# EAGLE design diybmsv4-00 (EAGLE 6.1)
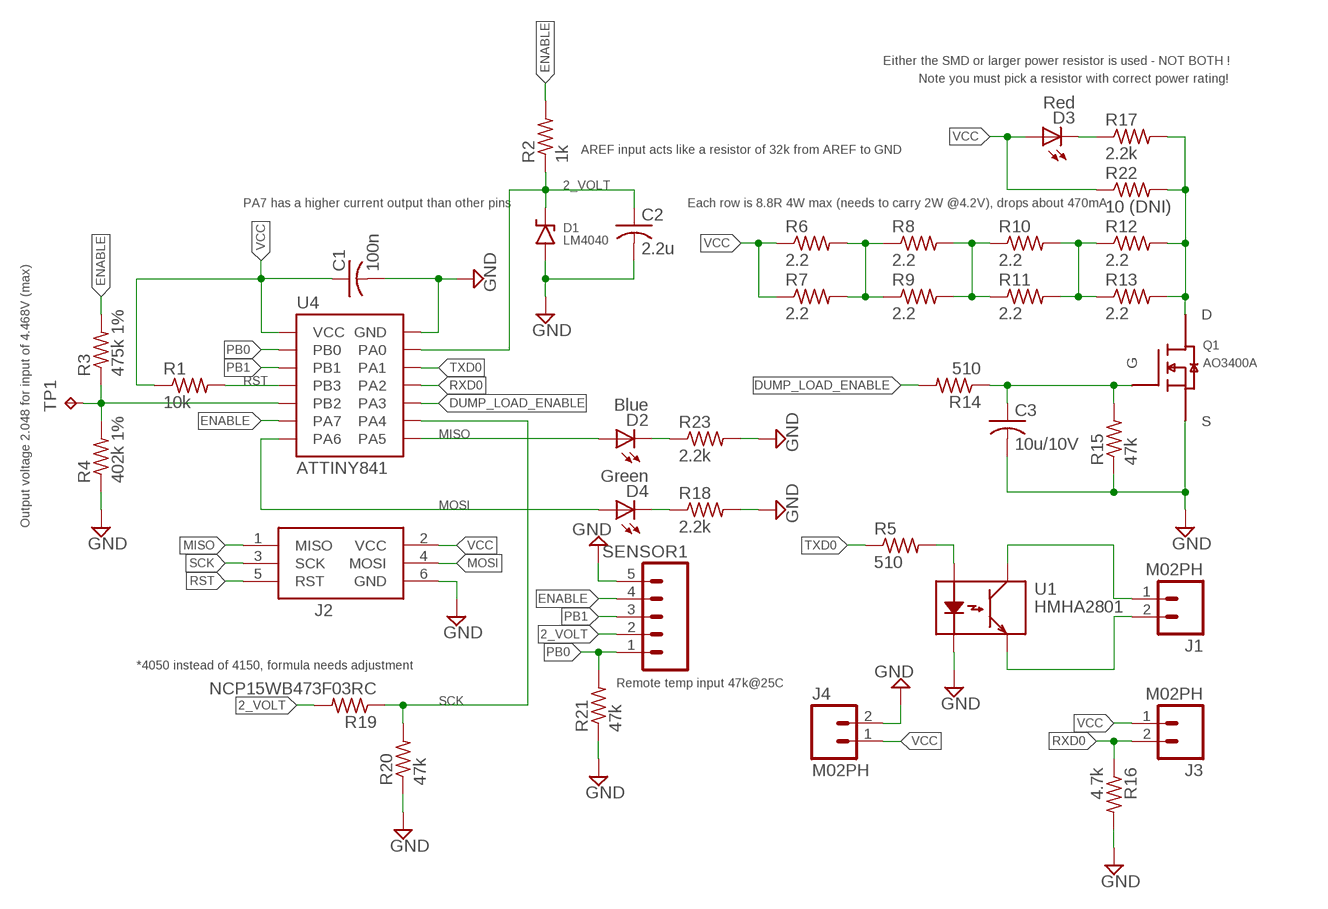
[diagram p0: schematic, sheet 1]

## Parts
C1  100n  C-USC0402  [C0402]
C2  2.2u  C-USC0402  [C0402]
C3  10u/10V  C-USC0402  [C0402]
D1  LM4040  [SOT23]
D2  Blue  LEDCHIPLED_0603  [CHIPLED_0603]
D3  Red  LEDCHIPLED_0603  [CHIPLED_0603]
D4  Green  LEDCHIPLED_0603  [CHIPLED_0603]
J1  M02PH  [S2B-PH-RA]
J2  AVRISP-6  [AVRISP]
J3  M02PH  [S2B-PH-RA]
J4  M02PH  [S2B-PH-RA]
Q1  AO3400A  AO3414  [SOT23]
R1  10k  R-US_R0402  [R0402]
R2  1k  R-US_R0402  [R0402]
R3  475k 1%  R-US_R0402  [R0402]
R4  402k 1%  R-US_R0402  [R0402]
R5  510  R-US_R0402  [R0402]
R6  2.2  R-US_R2512  [R2512]
R7  2.2  R-US_R2512  [R2512]
R8  2.2  R-US_R2512  [R2512]
R9  2.2  R-US_R2512  [R2512]
R10  2.2  R-US_R2512  [R2512]
R11  2.2  R-US_R2512  [R2512]
R12  2.2  R-US_R2512  [R2512]
R13  2.2  R-US_R2512  [R2512]
R14  510  R-US_R0402  [R0402]
R15  47k  R-US_R0402  [R0402]
R16  4.7k  R-US_R0402  [R0402]
R17  2.2k  R-US_R0402  [R0402]
R18  2.2k  R-US_R0402  [R0402]
R19  NCP15WB473F03RC  R-US_R0402  [R0402]
R20  47k  R-US_R0402  [R0402]
R21  47k  R-US_R0402  [R0402]
R22  10 (DNI)  RESISTOR25MM  [R-5W-22X9P5X9P5]
R23  2.2k  R-US_R0402  [R0402]
SENSOR1  M05PTH  [1X05]
TP1  TPTP15SQ  [TP15SQ]
U1  HMHA2801  [4-SOIC]
U4  ATTINY841  [14-SOIC]

## Nets
2_VOLT: C2.1 D1.1(K) R2.1 R19.2 SENSOR1.2 U4.13(PA0)
DLLED: D3.C R17.1
DRAIN: Q1.3(D) R12.2 R13.2 R17.2 R22.2
DUMP_LOAD_ENABLE: R14.2 U4.10(PA3)
ENABLE: R2.2 R3.2 SENSOR1.4 U4.6(PA7)
GATE: C3.1 Q1.1(G) R14.1 R15.2
GND: C1.2 C2.2 C3.2 D1.2(A) J2.6(GND) J4.2 Q1.2(S) R4.1 R15.1 R16.2 R18.2 R20.1 R21.1 R23.2 SENSOR1.5 U1.2(K) U4.14(GND)
MISO: D2.A J2.1(MISO) U4.8(PA5)
MOSI: D4.A J2.4(MOSI) U4.7(PA6)
N$1: J1.1 U1.4(C)
N$2: J1.2 U1.3(E)
N$3: D4.C R18.1
N$4: D2.C R23.1
N$5: R5.2 U1.1(A)
PB0: R21.2 SENSOR1.1 U4.2(PB0)
PB1: SENSOR1.3 U4.3(PB1)
PB2: R3.1 R4.2 TP1.TP U4.5(PB2)
R6789: R6.2 R7.2 R8.1 R9.1
R891011: R8.2 R9.2 R10.1 R11.1
R10111213: R10.2 R11.2 R12.1 R13.1
RST: J2.5(RST) R1.2 U4.4(PB3)
RXD0: J3.2 R16.1 U4.11(PA2)
SCK: J2.3(SCK) R19.1 R20.2 U4.9(PA4)
TXD0: R5.1 U4.12(PA1)
VCC: C1.1 D3.A J2.2(VCC) J3.1 J4.1 R1.1 R6.1 R7.1 R22.1 U4.1(VCC)

## Notes on the sheet
- Either the SMD or larger power resistor is used - NOT BOTH !
- Note you must pick a resistor with correct power rating!
- AREF input acts like a resistor of 32k from AREF to GND
- PA7 has a higher current output than other pins | Each row is 8.8R 4W max (needs to carry 2W @4.2V), drops about 470mA
- Output voltage 2.048 for input of 4.468V (max)
- *4050 instead of 4150, formula needs adjustment
- Remote temp input 47k@25C

## Library data of the parts
C1-C3 = resistor:C-US: CAPACITOR, American symbol
D1 = custom:LM4040: Voltage Reference Shunt 73uA
D2-D4 = led:LED: LED OSRAM: - CHIPLED LG R971, LG N971, LY N971, LG Q971, LY Q971, LO R971, LY R971 LH N974, LH R974 LS Q976, LO Q976, LY Q976 LO Q996 - Hyper CHIPLED LW Q18S LB Q993, LB Q99A, LB R99A - SideLED LS A670, LO A670, LY A670, LG A670, LP A670 LB A673, LV A673, LT A673, LW A673 LH A674 LY A675 LS A676, LA A676, LO A676, LY A676, LW A676 LS A679, LY A679, LG A679 - Hyper Micro SIDELED® LS Y876, LA Y876, LO Y876, LY Y876 LT Y87S - SmartLED LW L88C, LW L88S LB L89C, LB L89S, LG L890 LS L89K, LO L89K, LY L89K LS L896, LA L896, LO L896, LY L896 - TOPLED LS T670, LO T670, LY T670, LG T670, LP T670 LSG T670, LSP T670, LSY T670, LOP T670, LYG T670 LG T671, LOG T671, LSG T671 LB T673, LV T673, LT T673, LW T673 LH T674 LS T676, LA T676, LO T676, LY T676, LB T676, LH T676, LSB T676, LW T676 LB T67C, LV T67C, LT T67C, LS T67K, LO T67K, LY T67K, LW E67C LS E67B, LA E67B, LO E67B, LY E67B, LB E67C, LV E67C, LT E67C LW T67C LS T679, LY T679, LG T679 LS T770, LO T770, LY T770, LG T770, LP T770 LB T773, LV T773, LT T773, LW T773 LH T774 LS E675, LA E675, LY E675, LS T675 LS T776, LA T776, LO T776, LY T776, LB T776 LHGB T686 LT T68C, LB T68C - Hyper Mini TOPLED® LB M676 - Mini TOPLED Santana® LG M470 LS M47K, LO M47K, LY M47K Source: http://www.osram.convergy.de LUXEON: - LUMILED® LXK2-PW12-R00, LXK2-PW12-S00, LXK2-PW14-U00, LXK2-PW14-V00 LXK2-PM12-R00, LXK2-PM12-S00, LXK2-PM14-U00 LXK2-PE12-Q00, LXK2-PE12-R00, LXK2-PE12-S00, LXK2-PE14-T00, LXK2-PE14-U00 LXK2-PB12-K00, LXK2-PB12-L00, LXK2-PB12-M00, LXK2-PB14-N00, LXK2-PB14-P00, LXK2-PB14-Q00 LXK2-PR12-L00, LXK2-PR12-M00, LXK2-PR14-Q00, LXK2-PR14-R00 LXK2-PD12-Q00, LXK2-PD12-R00, LXK2-PD12-S00 LXK2-PH12-R00, LXK2-PH12-S00 LXK2-PL12-P00, LXK2-PL12-Q00, LXK2-PL12-R00 Source: www.luxeon.com KINGBRIGHT: KA-3528ASYC Source: www.kingbright.com
J1 J3 J4 = custom:M02
J2 = adafruit:AVRISP: AVR ISP HEADER Standard 6 pin header for AVR programming
Q1 = custom:AO3414: N-Channel MOSFET Logic Level 20V 3A 1.8V 50mOhm
R1-R21 R23 = resistor:R-US_: RESISTOR, American symbol
R22 = custom:RESISTOR
SENSOR1 = SparkFun:M05: Header 5 Standard 5-pin 0.1" header. Use with straight break away headers (SKU : PRT-00116), right angle break away headers (PRT-00553), swiss pins (PRT-00743), machine pins (PRT-00117), and female headers (PRT-00115). Molex polarized connector foot print use with SKU : PRT-08230 with associated crimp pins and housings.
TP1 = testpad:TP: Test pad
U1 = custom:HMHA2801: Optoisolator Transistor Output 3.75kVrms Isolation 80V 50mA
U4 = custom:ATTINY841: Atmel / Microchip 8-bit AVR Microcontroller 8KB 16MHz 512B EEPROM 512B SRAM 12x10b ADC

## Board
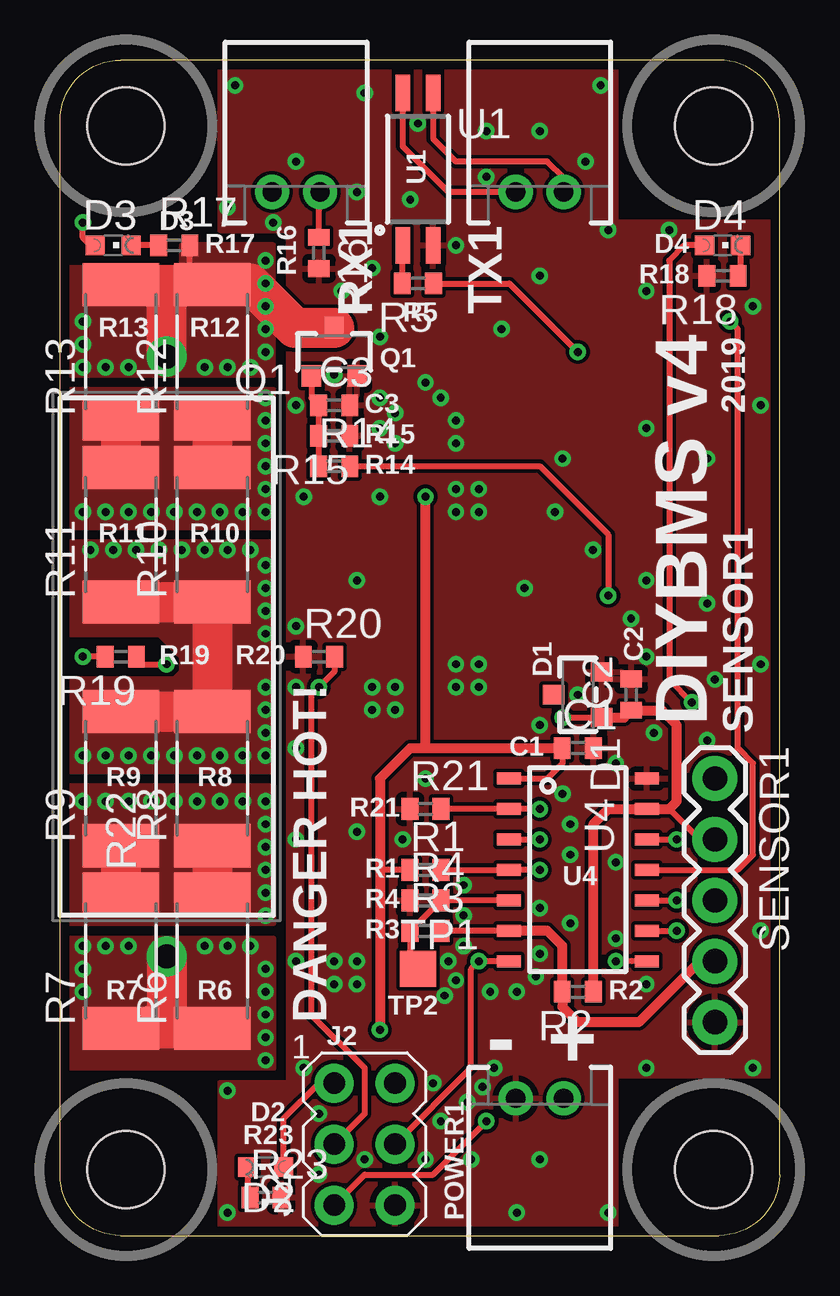
[diagram p1: board, top side]
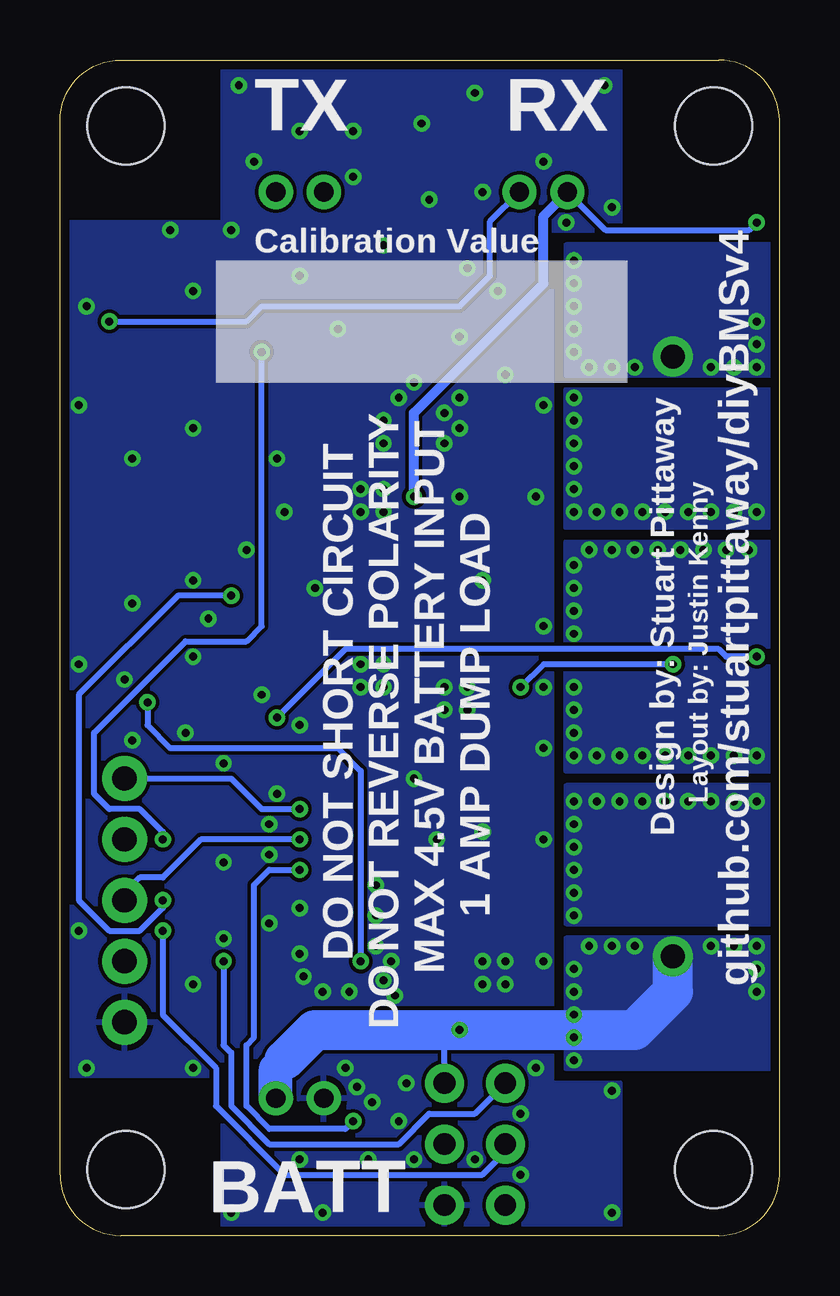
[diagram p2: board, bottom side, seen from below]

Size 30 x 49 mm. Coordinates in mm from the lower left corner, seen from the top.
Outline: 2.54,0 27.46,0 arc90 30,2.54 30,46.46 arc90 27.46,49 2.54,49 arc90 0,46.46 0,2.54 arc90 2.54,0
Copper layers (1*16): Top 0.0356mm / dielectric 1.5011mm / Bottom 0.0356mm
Design rules: minimum track width 6mil, minimum drill 13mil, track to track 6mil, track to pad 6mil, pad to pad 6mil, via to via 6mil, smd to smd 6mil, copper to edge 15mil, drill to drill 6mil, minimum pad ring 7mil, minimum via ring 7mil, stop-mask expansion 4mil, vias tented up to drill 20mil, thermal gap 10mil
Holes 3.2 mm at 2.75,2.75 27.25,2.75 2.75,46.25 27.25,46.25

### Footprints (pad centres in the part's own frame; a part is rotated, then mirrored left to right if it is on the bottom)
C0402 = smd 0.7 x 0.9: 1 -0.65,0; 2 0.65,0
SOT23 = smd 0.8 x 0.9: 1 0.95,1; 2 -0.95,1; 3 0,-1
CHIPLED_0603 = smd 0.8 x 0.8: A 0,-0.75; C 0,0.75
S2B-PH-RA = drill 0.8 pad 1.422: 1 -1,0; 2 1,0
AVRISP = drill 0.9 pad 1.626: 1 -1.27,2.54; 2 1.27,2.54; 3 -1.27,0; 4 1.27,0; 5 -1.27,-2.54; 6 1.27,-2.54
R0402 = smd 0.7 x 0.9: 1 -0.65,0; 2 0.65,0
R2512 = smd 1.8 x 3.2: 1 -2.8,0; 2 2.8,0
R-5W-22X9P5X9P5 = drill 1 pad 1.676: 1 -12.5,0; 2 12.5,0
1X05 = drill 1.016 pad 1.88: 1 0,0; 2 2.54,0; 3 5.08,0; 4 7.62,0; 5 10.16,0
TP15SQ = smd 1.5 x 1.5: TP 0,0
4-SOIC = smd 0.61 x 1.52: 1 -0.635,-3.175; 2 0.635,-3.175; 3 0.635,3.175; 4 -0.635,3.175
14-SOIC = smd 0.5 x 1: 1 -3.81,-2.875; 2 -2.54,-2.875; 3 -1.27,-2.875; 4 0,-2.875; 5 1.27,-2.875; 6 2.54,-2.875; 7 3.81,-2.875; 8 3.81,2.875; 9 2.54,2.875; 10 1.27,2.875; 11 0,2.875; 12 -1.27,2.875; 13 -2.54,2.875; 14 -3.81,2.875

### Placement (x,y rotation side)
C1  21.59,20.32 0 top
C2  23.81,22.54 90 top
C3  11.43,34.61 0 top
D1  21.59,22.54 270 top
D2  8.57,2.86 90 top
D3  2.22,41.27 270 top
D4  27.62,41.27 270 top
J1  20,43.5 0 top
J2  12.7,3.81 0 top
J3  9.84,43.5 0 top
J4  20,5.71 180 top
Q1  11.43,36.83 180 top
R1  15.24,15.24 0 top
R2  21.59,10.16 180 top
R3  15.24,12.7 0 top
R4  15.24,13.97 0 top
R5  14.92,39.69 180 top
R6  6.35,11.43 90 top
R7  2.54,11.43 90 top
R8  6.35,19.05 90 top
R9  2.54,19.05 90 top
R10  6.35,29.21 90 top
R11  2.54,29.21 90 top
R12  6.35,36.83 90 top
R13  2.54,36.83 90 top
R14  11.43,32.07 0 top
R15  11.43,33.34 180 top
R16  10.79,40.96 270 top
R17  4.76,41.27 0 top
R18  27.62,40.01 180 top
R19  2.54,24.13 180 top
R20  10.79,24.13 0 top
R21  15.24,17.78 0 top
R22  4.45,24.13 90 top
R23  8.57,1.59 0 top
SENSOR1  27.3,19.05 270 top
TP1  14.92,11.11 0 top
U1  14.92,44.45 0 top
U4  21.59,15.24 270 top

### Tracks (layer width: path | path; a pad name or v marks a point on that pad's centre or on a via)
2_VOLT  (via drill 0.33)
  Top 0.254: SENSOR1.2 26.67,16.51 25.4,17.78 | R19.2 v0.95,24.13 | v20.95,21.59 D1.1
  Top 0.406: R2.1 22.24,17.16 22.86,17.78 U4.13 25.4,17.78 25.72,18.1 25.72,21.27 25.1,21.89 C2.1 23.51,21.59 D1.1
  Bottom 0.254: v0.95,24.13 2.22,24.13 2.54,24.45 18.1,24.45 v20.95,21.59
DLLED
  Top 0.254: R17.1 D3.C
DRAIN  (via drill 0.33)
  Top 0.254: 4.76,39.63 5.41,40.28 R17.2
  Top 1.676: Q1.3 9.79,37.83 7.94,39.69 7.88,39.63 R12.2 4.76,39.63 | R13.2 4.76,39.63 | R22.2 4.45,39.31 4.76,39.63
  other vias: 0.95,36.2 1.91,36.2 2.86,36.2 6.03,36.2 6.99,36.2 7.94,36.2 8.57,36.83 8.57,37.78 8.57,38.73 8.57,39.69 8.57,40.64 0.95,37.15 0.95,38.1
  pour Top (no thermals): 0,35.88 8.89,35.88 8.89,41.27 5.08,41.27 5.08,40.32 0,40.32
  pour Bottom (no thermals): 0,41.27 8.89,41.27 8.89,35.88 0,35.88
DUMP_LOAD_ENABLE  (via drill 0.33)
  Top 0.254: R14.2 20,32.07 22.86,29.21 v22.86,26.67 | U4.10 v25.72,13.97
  Bottom 0.254: v22.86,26.67 25.08,26.67 29.21,22.54 29.21,13.97 27.94,12.7 26.67,12.7 25.72,13.65 v25.72,13.97
ENABLE
  Top 0.254: U4.6 R3.2
  Top 0.406: U4.6 20.32,12.7 20.94,12.08 R2.2 20.94,9.54 21.59,8.89 24.13,8.89 26.67,11.43 SENSOR1.4
GATE
  Top 0.254: Q1.1 10.48,34.91 C3.1 R15.2 R14.1
GND  (via drill 0.33)
  other vias: 17.78,44.13 14.92,46.35 16.51,41.27 11.75,39.37 8.89,42.23 13.34,34.92 13.97,34.29 13.34,33.66 13.97,33.02 16.51,33.02 16.51,33.97 15.88,34.92 15.24,35.56 16.51,31.11 17.46,31.11 16.51,30.16 17.46,30.16 16.51,23.81 17.46,23.81 16.51,22.86 17.46,22.86 13.97,21.91 13.97,22.86 13.02,22.86 13.02,21.91 12.38,10.48 11.43,10.48 11.43,11.43 12.38,11.43 16.83,12.06 16.19,11.43 20,11.75 16.51,10.64 17.94,10.16 16.03,10 19.05,10.16 19.84,10.79 17.14,3.17 15.24,3.17 15.88,4.76 12.7,3.17 10.79,5.08 10.79,2.54 15.56,6.35 10.16,6.99 20,3.17 20,13.65 21.27,13.02 21.27,15.88 21.27,17.14 20.95,18.41 23.18,19.68 24.77,20.95 20,21.27 21.59,22.54 24.45,24.13 24.45,27.3 23.81,25.72 27.3,23.18 29.21,23.81 9.84,22.86 9.84,25.4 9.84,16.51 9.84,20.32 9.84,11.43 6.99,6.03 6.99,0.95 22.86,0.95 24.45,6.99 29.21,12.7 23.18,15.56 15.24,19.05 14.29,16.51 12.38,16.83 16.83,14.61 16.83,13.34 22.23,28.57 20.95,32.38 20.64,30.16 24.45,33.66 26.99,32.38 29.21,34.61 26.99,26.35 24.45,39.37 28.89,38.73 25.4,41.91 20,40.01 18.41,37.78 13.02,40.32 14.61,43.18 17.78,46.04 22.54,47.94 7.3,47.94 6.99,42.86 9.84,44.77 12.38,43.5 21.91,44.77 22.86,41.91 20,46.04 12.7,47.62 10.16,30.8 9.84,34.61 11.43,35.88 13.34,37.47 13.34,30.8 19.37,26.99 12.38,27.3 28.89,6.99 19.05,0.95 26.99,20.64 24.45,10.48 23.18,12.38 18.1,6.99 17.62,6.19 16.99,5.56
  pour Top: 6.67,0 23.18,0 23.18,6.67 30.16,6.67 30.16,42.23 23.18,42.23 23.18,48.9 6.67,48.9 6.67,41.91 9.53,41.91 9.53,6.35 6.67,6.35
  pour Bottom: 6.67,0 23.18,0 23.18,6.67 30.16,6.67 30.16,42.23 23.18,42.23 23.18,48.9 6.67,48.9 6.67,41.91 9.53,41.91 9.53,6.35 6.67,6.35
MISO  (via drill 0.33)
  Top 0.254: U4.8 23.83,11.45 v23.18,11.43 | D2.A 9.32,4.88 10.79,6.35 J2.1
  Bottom 0.254: v23.18,11.43 23.18,7.94 22.86,7.62 22.86,5.4 21.27,3.81 15.88,3.81 14.61,5.08 12.7,5.08 J2.1
MOSI  (via drill 0.33)
  Top 0.254: U4.7 v17.46,11.43 17.14,11.11 17.14,6.99 J2.4 | D4.A 26.04,41.27 25.4,40.64 25.4,23.18 v26.35,22.23
  Bottom 0.254: v26.35,22.23 26.35,21.27 25.4,20.32 18.41,20.32 17.46,19.37 v17.46,11.43
N$1
  Top 0.254: U1.4 14.29,45.4 16.19,43.5 J1.1
N$2
  Top 0.254: J1.2 21,44.09 20.32,44.77 16.51,44.77 15.56,45.72 U1.3
N$3
  Top 0.254: D4.C 28.37,40.1 R18.1
N$4
  Top 0.254: D2.C 7.82,1.69 R23.1
N$5
  Top 0.254: R5.2 14.27,41.26 U1.1
PB0  (via drill 0.33)
  Top 0.254: R21.2 U4.2 v20,17.78
  Bottom 0.254: SENSOR1.1 22.86,19.05 21.59,17.78 v20,17.78
PB1  (via drill 0.33)
  Top 0.254: U4.3 v20,16.51
  Bottom 0.254: v20,16.51 24.13,16.51 25.72,14.92 26.67,14.92 27.3,14.29 SENSOR1.3
PB2
  Top 0.254: U4.5 R4.2 14.62,12.7 R3.1 14.59,11.45 TP1.TP
R6789  (via drill 0.33)
  Top 1.676: R8.1 R6.2 | R9.1 R7.2
  other vias: 0.95,18.1 1.91,18.1 2.86,18.1 3.81,18.1 4.76,18.1 5.71,18.1 6.67,18.1 7.62,18.1 8.57,18.1 8.57,13.34 8.57,14.29 8.57,15.24 8.57,16.19 8.57,17.14
  pour Top (no thermals): 0,18.73 8.89,18.73 8.89,13.02 0,13.02
  pour Bottom: 0,18.73 8.89,18.73 8.89,13.02 0,13.02
R891011  (via drill 0.33)
  Top 1.676: R10.1 R8.2 | R11.1 6.29,26.41 6.35,26.35 | R9.2 6.29,21.85 6.35,21.91
  other vias: 0.95,20 1.91,20 2.86,20 3.81,20 4.76,20 5.71,20 6.67,20 7.62,20 8.57,20 8.57,20.95 8.57,21.91 8.57,22.86 1.27,28.57 2.22,28.57 3.17,28.57 4.13,28.57 5.08,28.57 6.03,28.57 6.99,28.57 7.94,28.57 8.57,27.94 8.57,26.99 8.57,26.04 8.57,25.08
  pour Top (no thermals): 0,19.37 8.89,19.37 8.89,28.89 0,28.89 0,25.08 4.13,25.08 5.08,24.13 5.08,23.5 4.76,23.18 0,23.18
  pour Bottom: 0,19.37 8.89,19.37 8.89,28.89 0,28.89
R10111213  (via drill 0.33)
  Top 1.676: R12.1 R10.2 | R13.1 R11.2
  other vias: 0.95,30.16 1.91,30.16 2.86,30.16 3.81,30.16 4.76,30.16 5.71,30.16 6.67,30.16 7.62,30.16 8.57,30.16 8.57,31.11 8.57,32.07 8.57,33.02 8.57,33.97 8.57,34.92
  pour Bottom: 0,35.24 0,29.53 8.89,29.53 8.89,35.24
  pour Top (no thermals): 0,35.24 0,29.53 8.89,29.53 8.89,35.24
RST  (via drill 0.33)
  Top 0.254: R1.2 U4.4 v20,15.24 | J2.5 12.7,2.54 15.56,2.54 v17.78,4.76
  Bottom 0.254: v17.78,4.76 18.1,4.45 21.27,4.45 22.23,5.4 22.23,7.94 21.91,8.26 21.91,14.61 21.27,15.24 v20,15.24
RXD0  (via drill 0.33)
  Top 0.254: R16.1 10.79,43.45 J3.2 | U4.11 28.26,15.24 28.89,15.88 28.89,19.68 28.26,20.32 28.26,37.78 v27.94,38.1
  Bottom 0.254: v27.94,38.1 22.23,38.1 21.59,38.73 13.34,38.73 12.06,40.01 12.06,42.27 J3.2
SCK  (via drill 0.33)
  Top 0.254: U4.9 v25.72,12.7 | R20.2 11.45,23.51 v10.79,22.86 10.48,22.54 10.48,9.21 12.7,6.99 12.7,5.08 J2.3 | R19.1 3.19,24.11 3.49,23.81 v4.45,23.81
  Bottom 0.254: v25.72,12.7 25.72,9.21 23.5,6.99 23.5,5.4 20.64,2.54 12.38,2.54 11.43,3.49 J2.3 | v4.45,23.81 9.84,23.81 v10.79,22.86
TXD0  (via drill 0.33)
  Top 0.254: U4.12 v25.72,16.51 | v21.59,36.83 18.73,39.69 R5.1
  Bottom 0.254: v25.72,16.51 25.72,16.83 26.67,17.78 27.94,17.78 28.57,18.41 28.57,20.95 24.77,24.77 22.23,24.77 21.59,25.4 v21.59,36.83
VCC  (via drill 0.33)
  Top 0.254: 1.59,41.27 D3.A 1.27,41.27 0.95,41.59 v0.95,42.23 | R1.1 13.34,15.24 | U4.1 20.32,19.05 20.94,19.67 C1.1
  Top 0.406: v13.34,8.57 13.34,15.24 13.34,19.05 14.61,20.32 15.24,20.32 | 15.24,20.32 C1.1 | 15.24,20.32 v15.24,30.8
  Top 1.676: R7.1 3.81,8.63 | 3.81,8.63 R6.1 | R22.1 4.45,9.27 3.81,8.63
  Bottom 0.254: J3.1 7.25,41.91 1.27,41.91 v0.95,42.23 | J2.2 13.97,8.57
  Bottom 0.406: v15.24,30.8 15.24,34.29 9.84,39.69 9.84,42.5 J3.1
  Bottom 1.422: J4.1 21,6.94 20.64,7.3
  Bottom 1.676: 20.64,7.3 19.37,8.57 13.97,8.57 v13.34,8.57 6.03,8.57 4.45,10.16 R22.1
  other vias: 0.95,12.06 1.91,12.06 2.86,12.06 6.03,12.06 6.99,12.06 7.94,12.06 8.57,11.11 8.57,10.16 8.57,9.21 8.57,8.26 8.57,7.3 0.95,11.11 0.95,10.16
  pour Top (no thermals): 0,12.38 8.89,12.38 8.89,6.99 0,6.99
  pour Bottom (no thermals): 0,12.38 8.89,12.38 8.89,6.99 0,6.99

### Text on the board
tPlace: U1 | D3 | R17 | D4 | R16 | R18 | RX1 | R5 | TX1 | R13 | R12 | Q1 | C3 | 2019 | R15 | R14 | R11 | R10 | D1 | C2 | R19 | R20 | DIYBMS v4 | SENSOR1 | C1 | R9 | R8 | R21 | R1 | U4 | R4 | R3 | R7 | R6 | R2 | DANGER HOT! | TP2 | J2 | - | + | D2 | R23 | POWER1
bPlace: RX | TX | github.com/stuartpittaway/diyBMSv4 | Calibration Value | Design by: Stuart Pittaway | MAX 4.5V BATTERY INPUT | DO NOT REVERSE POLARITY | DO NOT SHORT CIRCUIT | Layout by: Justin Kenny | 1 AMP DUMP LOAD | BATT